# EAGLE design X9-Backplane (EAGLE 7.7.0)
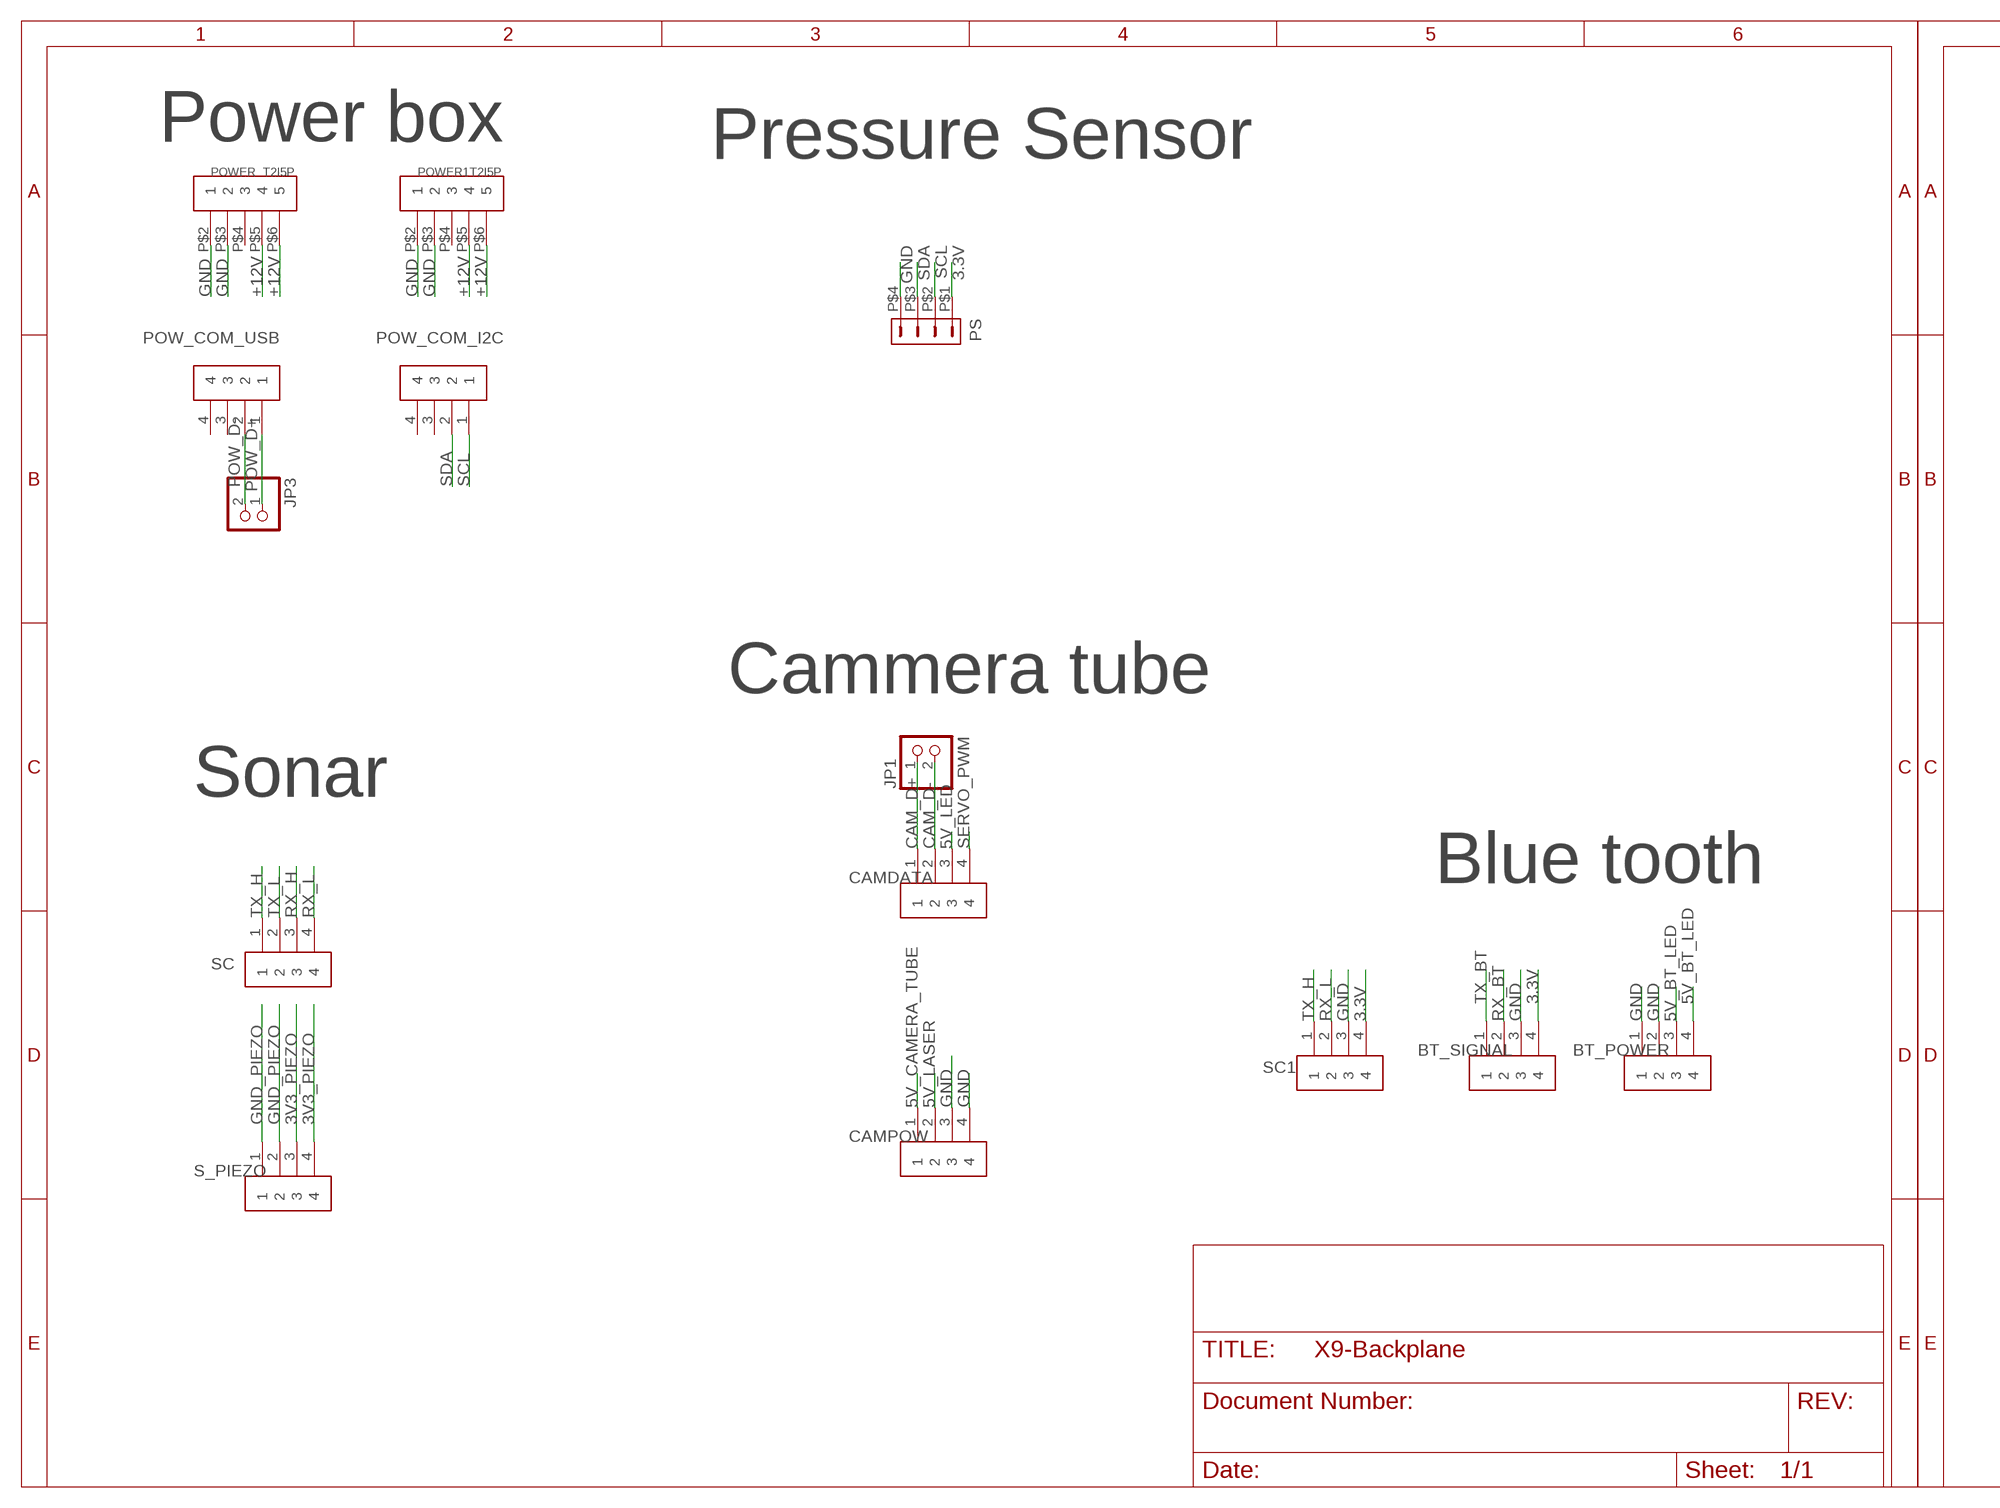
[diagram p0: schematic, sheet 1, part 1 of 2]
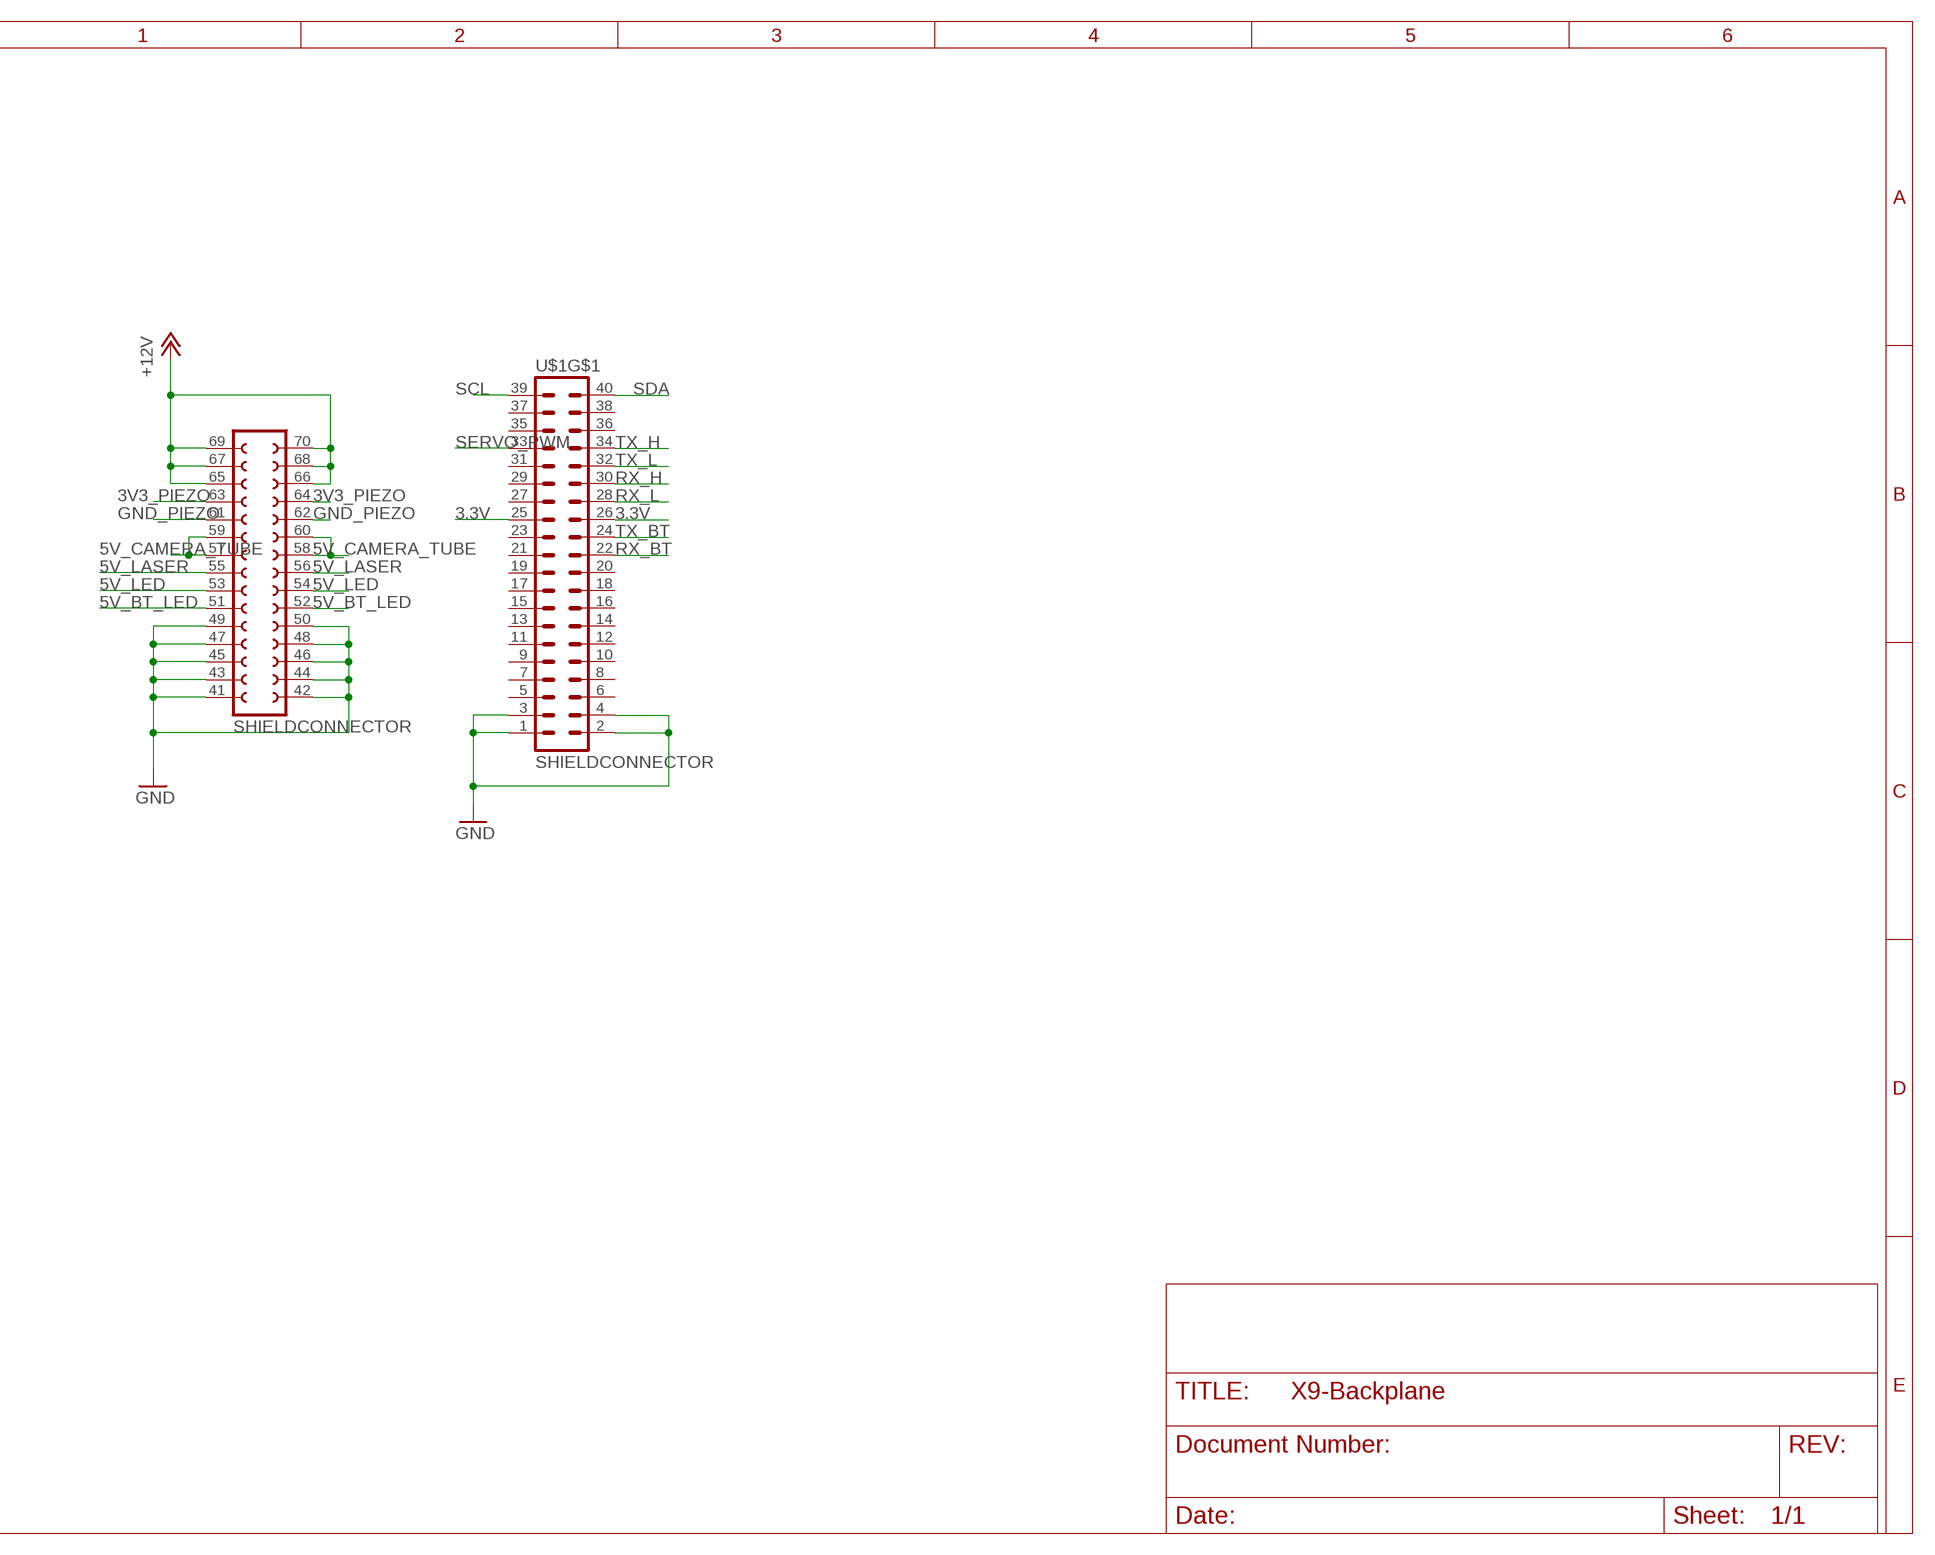
[diagram p1: schematic, sheet 1, part 2 of 2]

## Parts
BT_POWER  T2I  [T2I]
BT_SIGNAL  T2I  [T2I]
CAMDATA  T2I  [T2I]
CAMPOW  T2I  [T2I]
JP1  PINHD-1X2  [1X02]
JP3  PINHD-1X2  [1X02]
POW_COM_I2C  T2I  [T2I]
POW_COM_USB  T2I  [T2I]
POWER  T2I5P  [T2I5P]
POWER1  T2I5P  [T2I5P]
PS  DF13-4P-1.25DSA  [DF13-4P-1.25DSA]
S_PIEZO  T2I  [T2I]
SC  T2I  [T2I]
SC1  T2I  [T2I]
U$1  SHIELDCONNECTOR  [20X2PIN]

## Nets
3.3V: BT_SIGNAL.4 PS.P$1 SC1.4 U$1.25 U$1.26
3V3_PIEZO: S_PIEZO.3 S_PIEZO.4 U$1.63(3V3_PIEZO) U$1.64(3V3_PIEZO)
5V_BT_LED: BT_POWER.3 BT_POWER.4 U$1.51(5V_BT_LED) U$1.52(5V_BT_LED)
5V_CAMERA_TUBE: CAMPOW.1 U$1.57(5V_CAMERA_TUBE) U$1.58(5V_CAMERA_TUBE) U$1.59 U$1.60
5V_LASER: CAMPOW.2 U$1.55(5V_LASER) U$1.56(5V_LASER)
5V_LED: CAMDATA.3 U$1.53(5V_LED) U$1.54(5V_LED)
+12V: POWER1.P$5 POWER1.P$6 POWER.P$5 POWER.P$6 U$1.65(12V) U$1.66(12V) U$1.67(12V) U$1.68(12V) U$1.69(12V) U$1.70(12V)
CAM_D+: CAMDATA.1 JP1.1
CAM_D-: CAMDATA.2 JP1.2
GND: BT_POWER.1 BT_POWER.2 BT_SIGNAL.3 CAMPOW.3 CAMPOW.4 POWER1.P$2 POWER1.P$3 POWER.P$2 POWER.P$3 PS.P$4 SC1.3 U$1.1 U$1.2 U$1.3 U$1.4 U$1.41(GND) U$1.42(GND) U$1.43(GND) U$1.44(GND) U$1.45(GND) U$1.46(GND) U$1.47(GND) U$1.48(GND) U$1.49(GND) U$1.50(GND)
GND_PIEZO: S_PIEZO.1 S_PIEZO.2 U$1.61(GND_PIEZO) U$1.62(GND_PIEZO)
POW_D+: JP3.1 POW_COM_USB.1
POW_D-: JP3.2 POW_COM_USB.2
RX_BT: BT_SIGNAL.2 U$1.22
RX_H: SC.3 U$1.30(Z)
RX_L: SC1.2 SC.4 U$1.28(Y)
SCL: POW_COM_I2C.1 PS.P$2 U$1.39(SCL)
SDA: POW_COM_I2C.2 PS.P$3 U$1.40(SDA)
SERVO_PWM: CAMDATA.4 U$1.33(SERVO_PWM)
TX_BT: BT_SIGNAL.1 U$1.24
TX_H: SC1.1 SC.1 U$1.34(A)
TX_L: SC.2 U$1.32(B)
Unconnected: POW_COM_I2C.3 POW_COM_I2C.4 POW_COM_USB.3 POW_COM_USB.4 POWER1.P$4 POWER.P$4 U$1.5 U$1.6 U$1.7 U$1.8 U$1.9 U$1.10 U$1.11 U$1.12 U$1.13 U$1.14 U$1.15 U$1.16 U$1.17 U$1.18 U$1.19 U$1.20 U$1.21 U$1.23 U$1.27 U$1.29 U$1.31 U$1.35(DSCLP) U$1.36(DSCLM) U$1.37(DSDAP) U$1.38(DSDAM)

## Notes on the sheet
- Power box | Pressure Sensor
- Cammera tube
- Sonar
- Blue tooth

## Library data of the parts
BT_POWER BT_SIGNAL CAMDATA CAMPOW POW_COM_I2C POW_COM_USB S_PIEZO SC SC1 = BACKPLANE:T2I
JP1 JP3 = pinhead:PINHD-1X2: PIN HEADER
POWER POWER1 = T2I5P:T2I5P
PS = con-hirose-df13:DF13-4P-1.25: DF13-4P 1.25mm Pitch Miniature Crimping Connector.
U$1 = backplane_to_shield_connector:SHIELDCONNECTOR

## Board
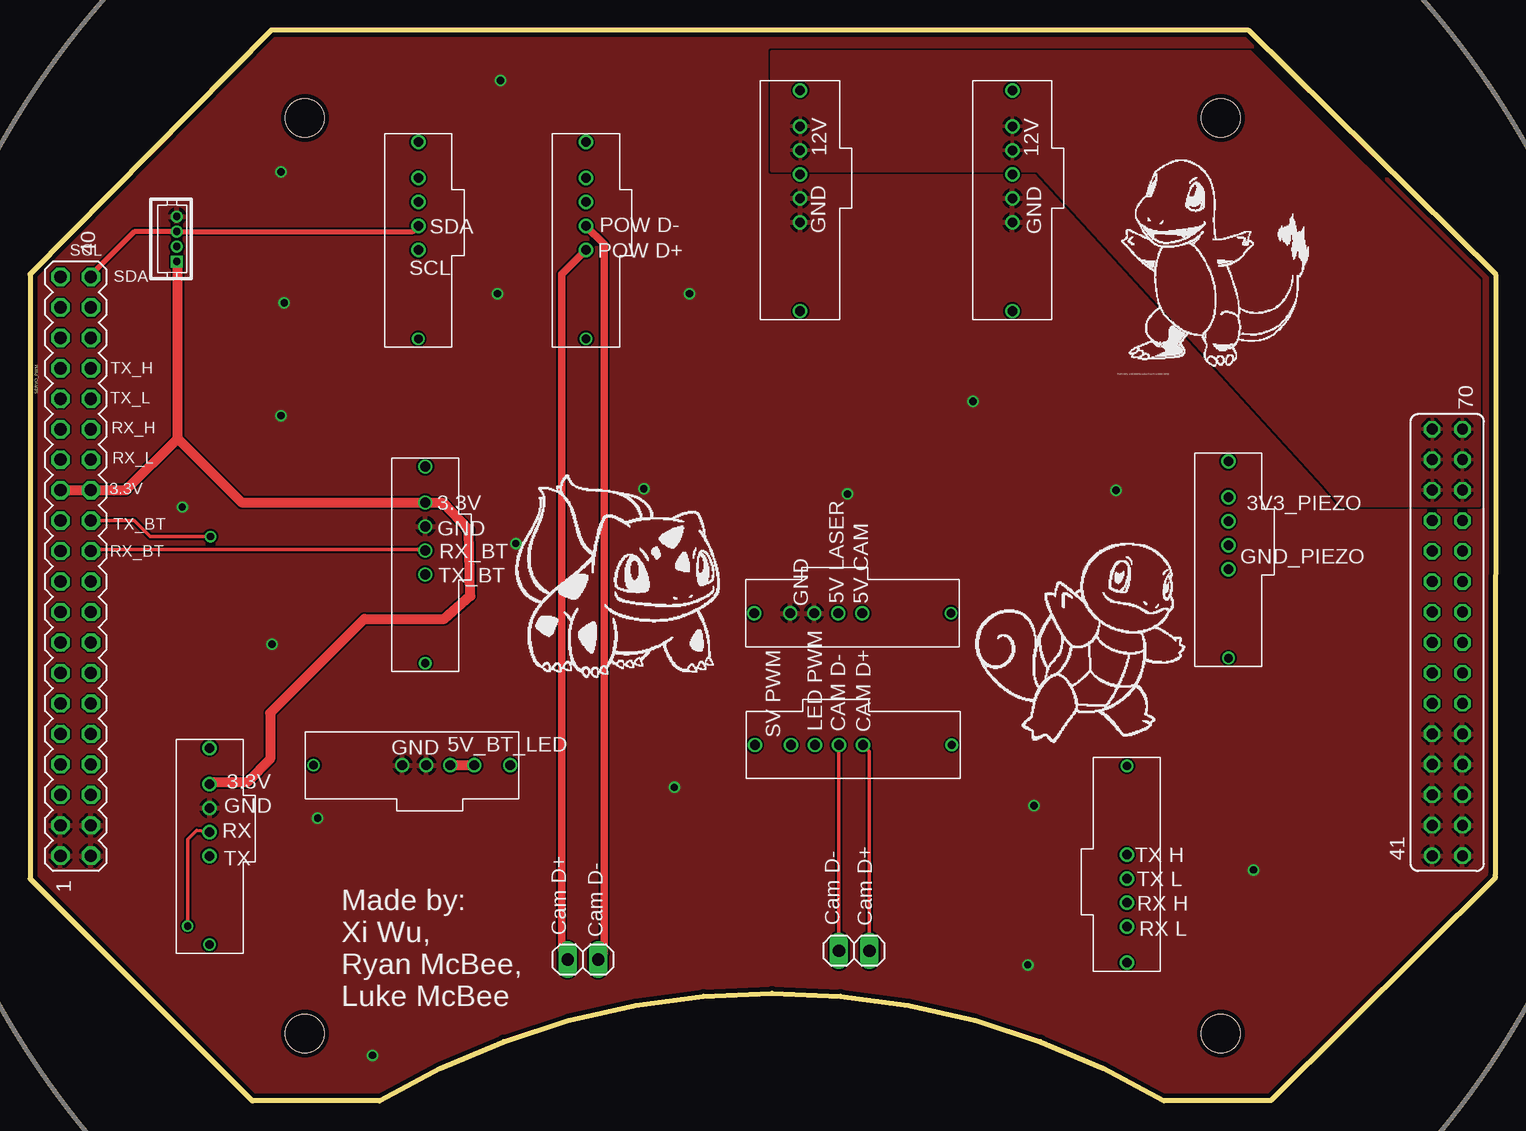
[diagram p2: board, top side]
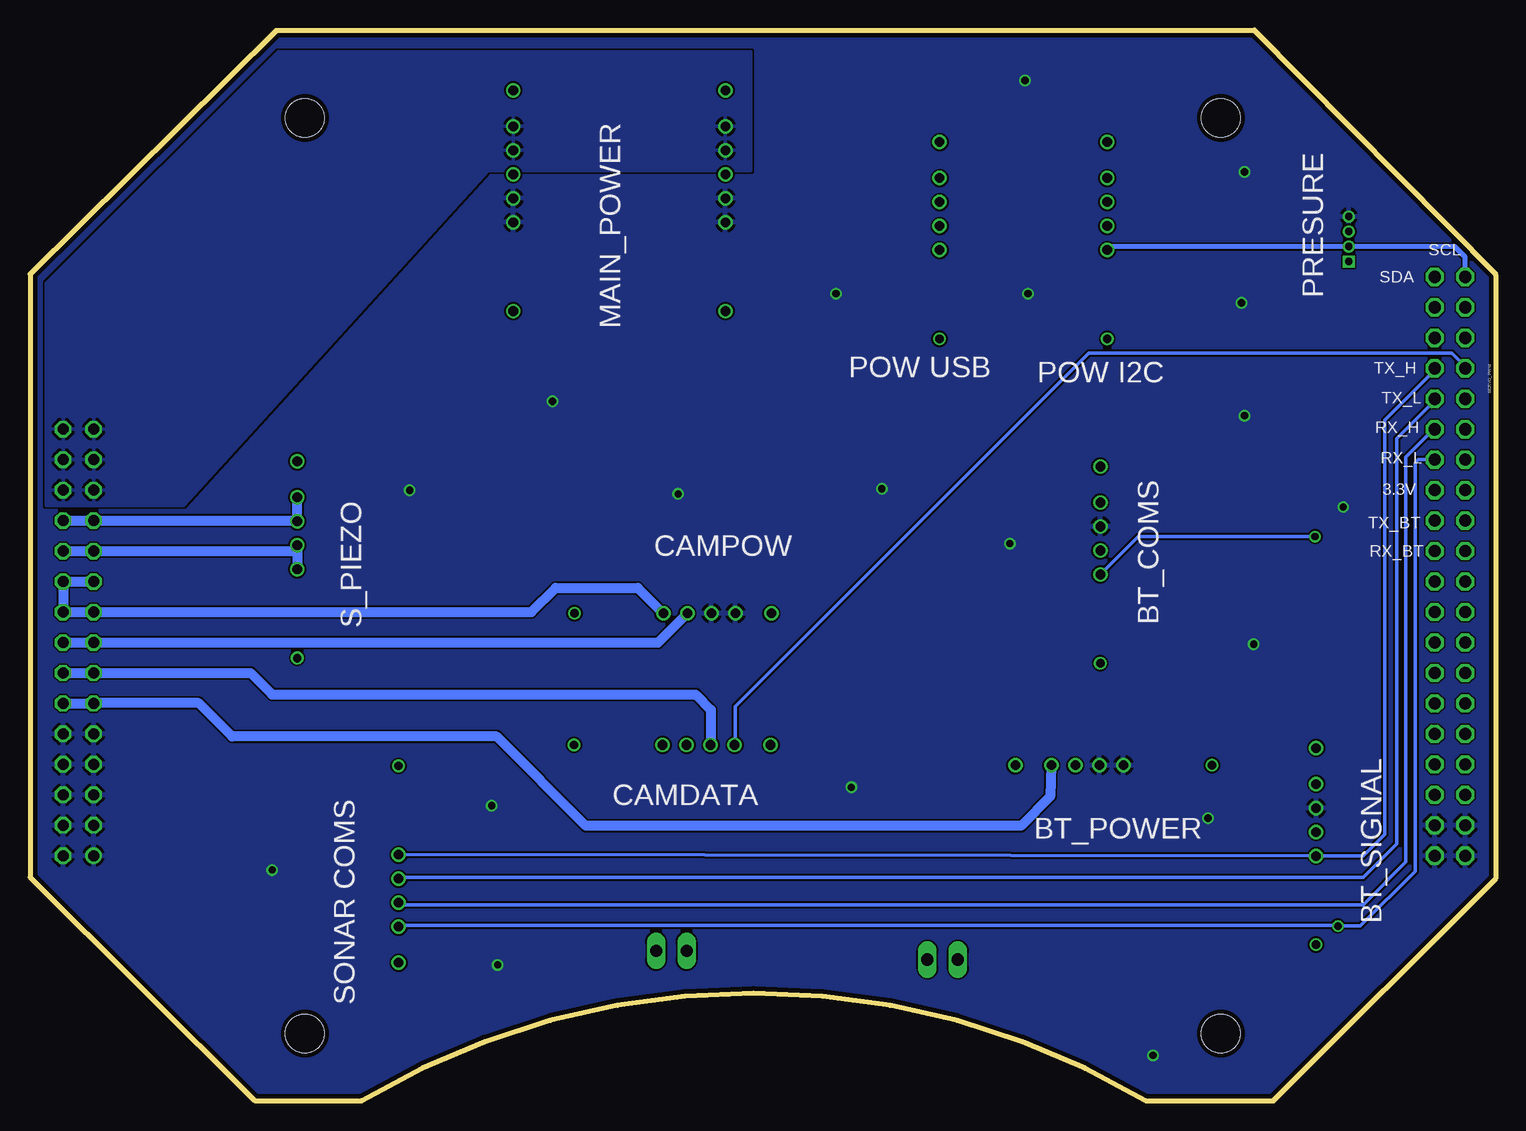
[diagram p3: board, bottom side, seen from below]

Size 122.13 x 89.28 mm. Coordinates in mm from the lower left corner, seen from the top.
Outline: 0,68.93 20.09,89.28 101.58,89.26 122.13,68.93
Outline: 122.13,18.64 103.44,0.05
Outline: 122.13,68.9 122.1,18.84
Outline: 29.11,0 18.57,0
Outline: 103.41,0.03 94.52,0
Outline: 29.16,0.03 arc-61 94.49,0.03
Outline: 0,68.88 0,18.52 18.52,0
Copper layers (1*16): Top 0.0356mm / dielectric 1.5011mm / Bottom 0.0356mm
Design rules "OSHpark": minimum track width 6mil, minimum drill 13mil, track to track 6mil, track to pad 6mil, pad to pad 6mil, via to via 6mil, smd to smd 6mil, copper to edge 15mil, drill to drill 6mil, minimum pad ring 7mil, minimum via ring 7mil, stop-mask expansion 3mil, vias tented up to drill 0mil, thermal gap 10mil
Holes 3.2 mm at 22.9,81.95 22.9,5.62 99.23,5.62 99.23,81.95

### Footprints (pad centres in the part's own frame; a part is rotated, then mirrored left to right if it is on the bottom)
T2I = drill 0.8: 1 8.1,2.8; 2 10.1,2.8; 3 12.1,2.8; 4 14.1,2.8; S2 17.1,2.8 | drill 0.7: S1 0.7,2.8
1X02 = drill 1.016 long: 1 -1.27,0; 2 1.27,0
T2I5P = drill 0.8: P$1 -19.1,3.3; P$2 -11.7,3.3; P$3 -9.7,3.3; P$4 -7.7,3.3; P$5 -5.7,3.3; P$6 -3.7,3.3; P$7 -0.7,3.3
DF13-4P-1.25DSA = drill 0.6 pad 1.016 square: P$1 1.875,0 | drill 0.6 pad 1.016: P$2 0.625,0; P$3 -0.625,0; P$4 -1.875,0
20X2PIN = drill 1.016 octagon: 1 -55.88,-26.67; 2 -53.34,-26.67; 3 -55.88,-24.13; 4 -53.34,-24.13; 5 -55.88,-21.59; 6 -53.34,-21.59; 7 -55.88,-19.05; 8 -53.34,-19.05; 9 -55.88,-16.51; 10 -53.34,-16.51; 11 -55.88,-13.97; 12 -53.34,-13.97; 13 -55.88,-11.43; 14 -53.34,-11.43; 15 -55.88,-8.89; 16 -53.34,-8.89; 17 -55.88,-6.35; 18 -53.34,-6.35; 19 -55.88,-3.81; 20 -53.34,-3.81; 21 -55.88,-1.27; 22 -53.34,-1.27; 23 -55.88,1.27; 24 -53.34,1.27; 25 -55.88,3.81; 26 -53.34,3.81; 27 -55.88,6.35; 28 -53.34,6.35; 29 -55.88,8.89; 30 -53.34,8.89; 31 -55.88,11.43; 32 -53.34,11.43; 33 -55.88,13.97; 34 -53.34,13.97; 35 -55.88,16.51; 36 -53.34,16.51; 37 -55.88,19.05; 38 -53.34,19.05; 39 -55.88,21.59; 40 -53.34,21.59 | drill 0.914: 41 58.42,-26.67 | drill 0.914 octagon: 42 60.96,-26.67; 43 58.42,-24.13; 44 60.96,-24.13; 45 58.42,-21.59; 46 60.96,-21.59; 47 58.42,-19.05; 48 60.96,-19.05; 49 58.42,-16.51; 50 60.96,-16.51; 51 58.42,-13.97; 52 60.96,-13.97; 53 58.42,-11.43; 54 60.96,-11.43; 55 58.42,-8.89; 56 60.96,-8.89; 57 58.42,-6.35; 58 60.96,-6.35; 59 58.42,-3.81; 60 60.96,-3.81; 61 58.42,-1.27; 62 60.96,-1.27; 63 58.42,1.27; 64 60.96,1.27; 65 58.42,3.81; 66 60.96,3.81; 67 58.42,6.35; 68 60.96,6.35; 69 58.42,8.89; 70 60.96,8.89

### Placement (x,y rotation side)
BT_POWER  22.92,25.18 0 top
BT_SIGNAL  35.74,35.79 90 top
CAMDATA  77.51,32.47 180 top
CAMPOW  77.45,43.45 180 top
JP1  68.68,12.52 180 top
JP3  46.08,11.79 0 top
POW_COM_I2C  35.16,62.84 90 top
POW_COM_USB  49.13,62.84 90 top
POWER  67.47,84.95 90 top
POWER1  85.16,84.95 90 top
PS  12.24,71.86 270 top
S_PIEZO  102.66,36.22 90 top
SC  88.61,28.63 270 top
SC1  17.76,12.32 90 top
U$1  58.41,47.11 0 top

### Tracks (layer width: path | path; a pad name or v marks a point on that pad's centre or on a via)
3.3V
  Top 0.813: U$1.25 U$1.26 7.99,50.92 12.3,55.22 | 12.3,55.22 12.3,69.92 PS.P$1 | 12.3,55.22 17.63,49.89 BT_SIGNAL.4 32.69,49.83 34.45,49.83 36.56,47.57 36.71,42.09 34.52,40.18 27.87,40.18 20.02,32.33 20.02,28.5 18.09,26.57 14.96,26.57 SC1.4
3V3_PIEZO
  Bottom 0.813: U$1.64 U$1.63 99.86,48.38 S_PIEZO.3 S_PIEZO.4
5V_BT_LED
  Top 0.813: BT_POWER.4 BT_POWER.3
  Bottom 0.813: U$1.52 U$1.51 116.8,33.17 108.08,33.17 105.29,30.38 83.24,30.38 75.8,22.94 39.53,22.94 37.12,25.37 BT_POWER.4
5V_CAMERA_TUBE
  Bottom 0.813: U$1.59 U$1.60 U$1.58 U$1.57 80.36,40.76 78.34,42.77 71.47,42.77 CAMPOW.1
5V_LASER
  Bottom 0.813: U$1.56 U$1.55 69.79,38.22 CAMPOW.2
5V_LED
  Bottom 0.813: U$1.54 U$1.53 103.75,35.68 101.96,33.88 66.65,33.88 65.38,32.61 65.38,29.7 CAMDATA.3
+12V
  pour Bottom: 109.33,49.63 120.76,49.63 120.76,68.17 101.45,87.48 62.08,87.48 62.08,77.57 83.93,77.57
  pour Top: 109.33,49.63 120.76,49.63 120.76,68.43 101.71,87.48 61.83,87.48 61.83,77.57 83.93,77.57 107.8,51.41
CAM_D+
  Top 0.305: JP1.1 69.95,29.13 CAMDATA.1
CAM_D-
  Top 0.305: JP1.2 CAMDATA.2
GND  (via drill 0.6)
  other vias: 28.54,3.79 53.69,26.14 23.97,23.58 20.16,38.08 20.92,57.13 21.18,66.53 38.96,67.29 54.96,67.29 20.92,77.45 39.21,85.07 51.15,51.03 40.48,46.46 83.66,24.62 12.7,49.51 68.12,50.6 78.58,58.32 90.5,50.91 101.95,19.26 83.15,11.33
  pour Bottom (rank 6): 34.24,106.07 90.03,108.32 125,71.45 122.56,18.47 86.49,-17.6 35.92,-17.42 -0.15,18.64 -1.82,70
  pour Top (rank 6): -1.16,69.39 34.9,105.46 88.98,105.54 124.8,69.72 123.12,17.73 98.48,-9.17 30.13,-10.69 -0.15,18.64
GND_PIEZO
  Bottom 0.813: U$1.62 U$1.61 99.86,45.84 S_PIEZO.2 S_PIEZO.1
POW_D+
  Top 0.305: JP3.1 44.81,12.04 44.3,12.55
  Top 0.61: 44.3,12.55 44.3,68.91 POW_COM_USB.1
POW_D-
  Top 0.305: JP3.2 47.86,12.29
  Top 0.61: 47.86,12.29 47.86,71.41 POW_COM_USB.2
RX_BT
  Top 0.305: BT_SIGNAL.2 32.86,45.96 5.07,45.96 U$1.22
RX_H
  Bottom 0.305: U$1.30 5.17,56 7.47,53.7 7.47,19.91 11.03,16.36 91.24,16.36 SC.3 91.37,16.56
RX_L  (via drill 0.6)
  Top 0.305: SC1.2 13.89,22.57 13.14,21.82 v13.14,14.58
  Bottom 0.305: U$1.28 6.44,53.46 6.71,53.19 6.71,19.15 11.28,14.58 v13.14,14.58 13.19,14.63 91.3,14.63 SC.4 91.36,14.58
SCL
  Bottom 0.305: 12.23,71.22 PS.P$2
  Bottom 0.406: 2.53,69.33 U$1.39 2.53,70.35 3.41,71.22 12.23,71.22 | PS.P$2 32.07,71.23 POW_COM_I2C.1
SDA
  Top 0.305: U$1.40 5.07,68.82 | 12.23,72.49 PS.P$3
  Top 0.406: 5.07,68.82 8.74,72.49 12.23,72.49 | PS.P$3 31.9,72.48 POW_COM_I2C.2
SERVO_PWM
  Bottom 0.305: U$1.33 2.53,61.2 3.66,62.33 33.89,62.33 63.35,32.87 63.35,29.73 CAMDATA.4
TX_BT  (via drill 0.6)
  Top 0.305: U$1.24 8.7,48.38 10.01,47.07 15.02,47.07 v15.04,47.04
  Bottom 0.305: v15.04,47.04 29.79,47.04 BT_SIGNAL.1
TX_H
  Bottom 0.305: U$1.34 5.07,60.92 9.25,56.74 9.25,22.2 11.03,20.42 14.81,20.42 SC1.1 91.36,20.57 SC.1
TX_L
  Bottom 0.305: U$1.32 5.07,58.38 8.23,55.22 8.23,21.44 11.03,18.64 91.29,18.64 SC.2 91.37,18.49

### Text on the board
tPlace: 12V | 12V | SDA | POW D- | GND | GND | SCL | POW D+ | SDA | SCL | TX_H | /home/ryan/Downloads/charmander.bmp | SERVO_PWM | TX_L | RX_H | RX_L | 3.3V | 3.3V | 3V3_PIEZO | TX_BT | GND | RX_BT | RX_BT | GND_PIEZO | TX_BT | GND | 5V LASER | 5V CAM | SV PWM | LED PWM | CAM D- | CAM D+ | GND | 5V_BT_LED | 3.3V | GND | RX | TX H | TX | TX L | RX H | Cam D- | Cam D+ | RX L | Cam D+ | Cam D- | Made by: / Xi Wu, / Ryan McBee, / Luke McBee
bPlace: MAIN_POWER | SCL | SDA | PRESURE | POW I2C | POW USB | TX_H | SERVO_PWM | TX_L | RX_H | RX_L | BT_COMS | 3.3V | S_PIEZO | TX_BT | RX_BT | CAMPOW | BT_SIGNAL | CAMDATA | SONAR COMS | BT_POWER